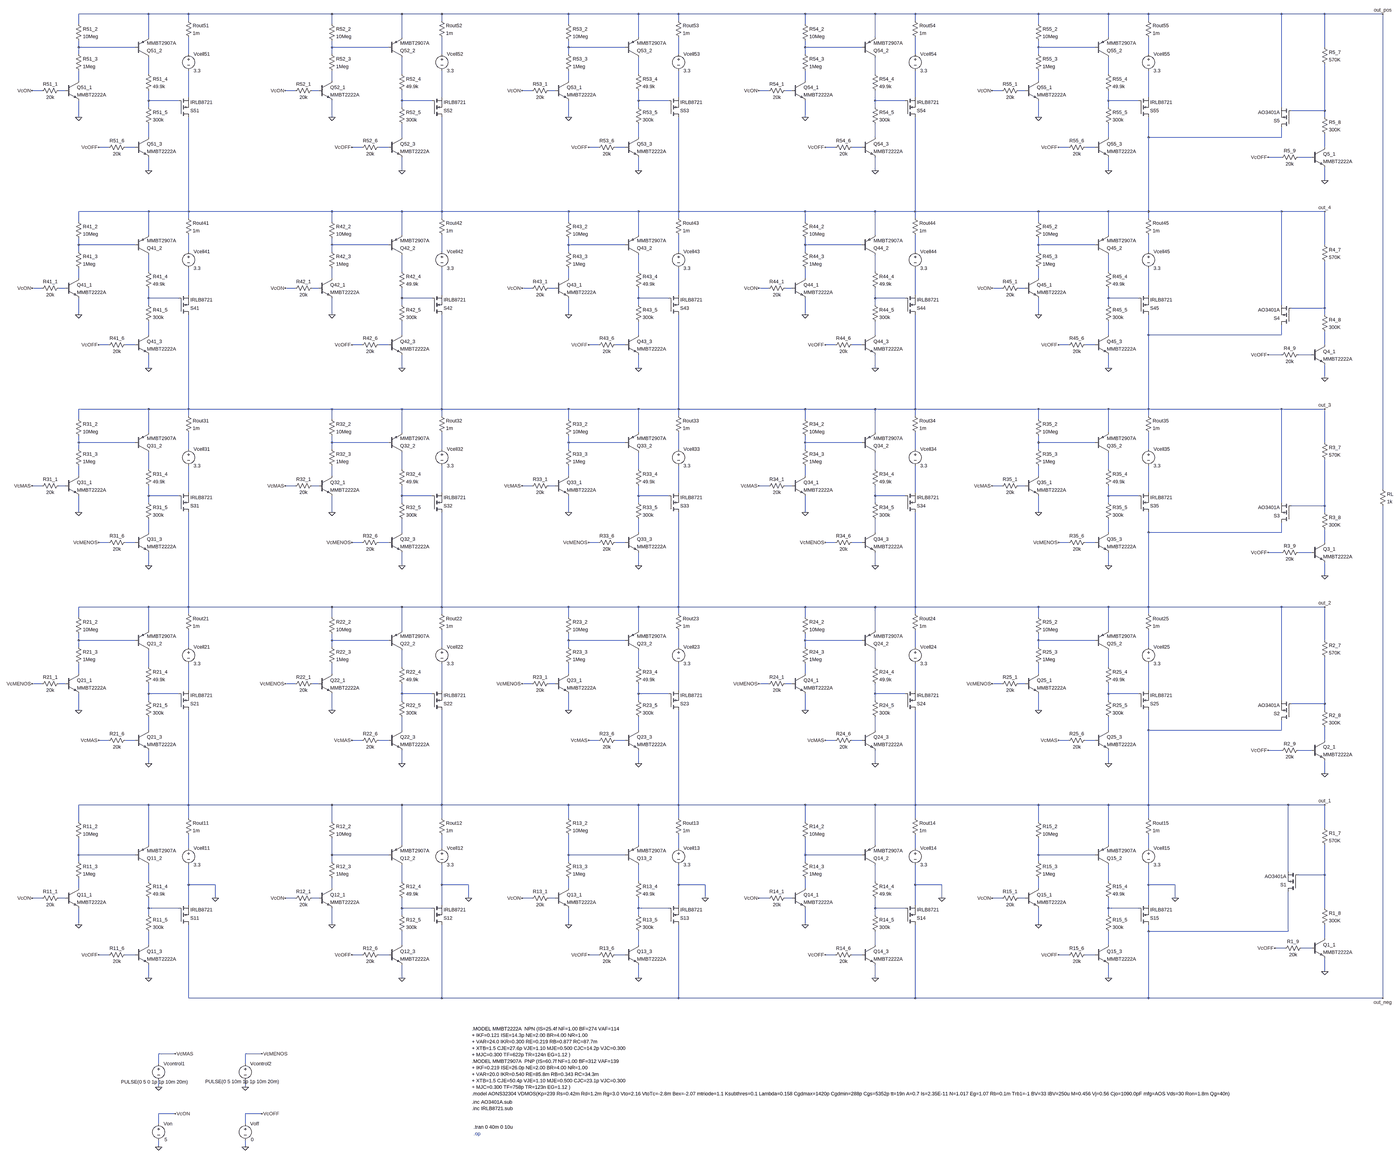
[diagram p0: schematic version2.1.asc, whole sheet]
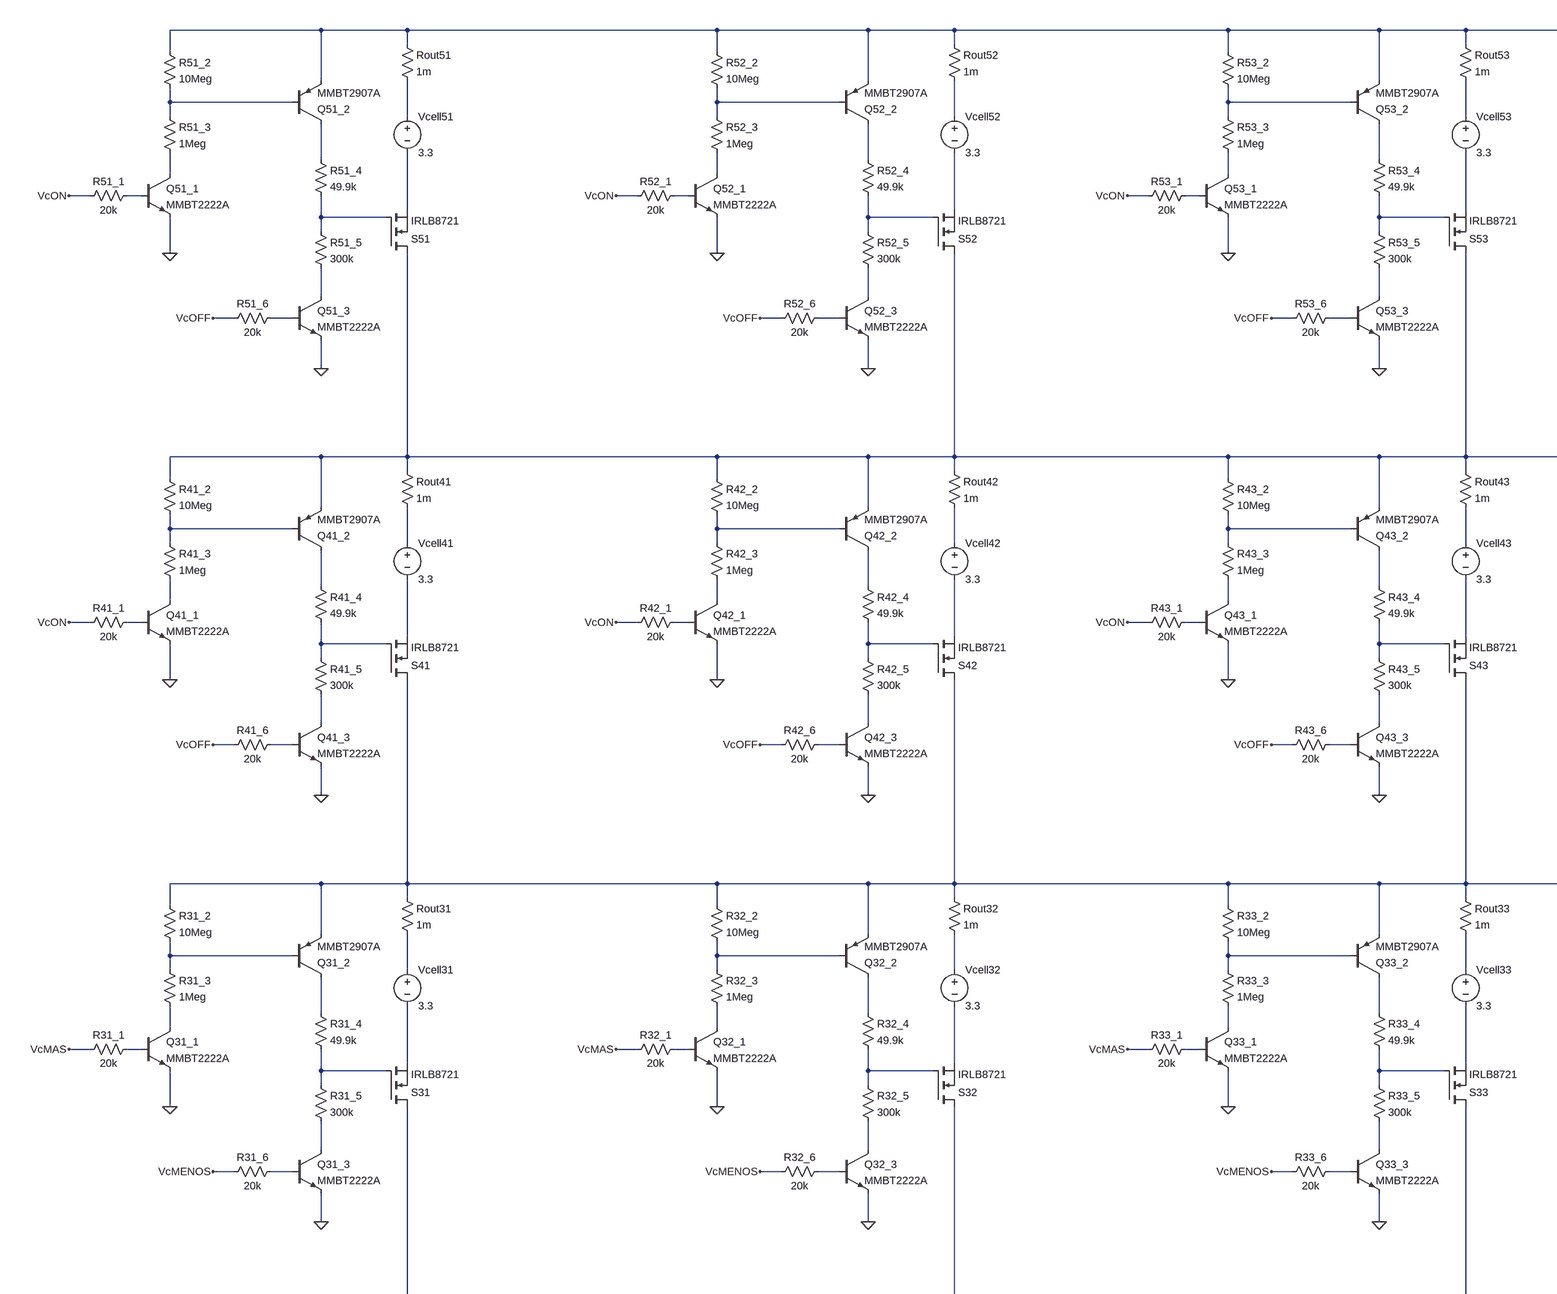
[diagram p1: schematic version2.1.asc, part, row 1 of 2, column 1 of 2]
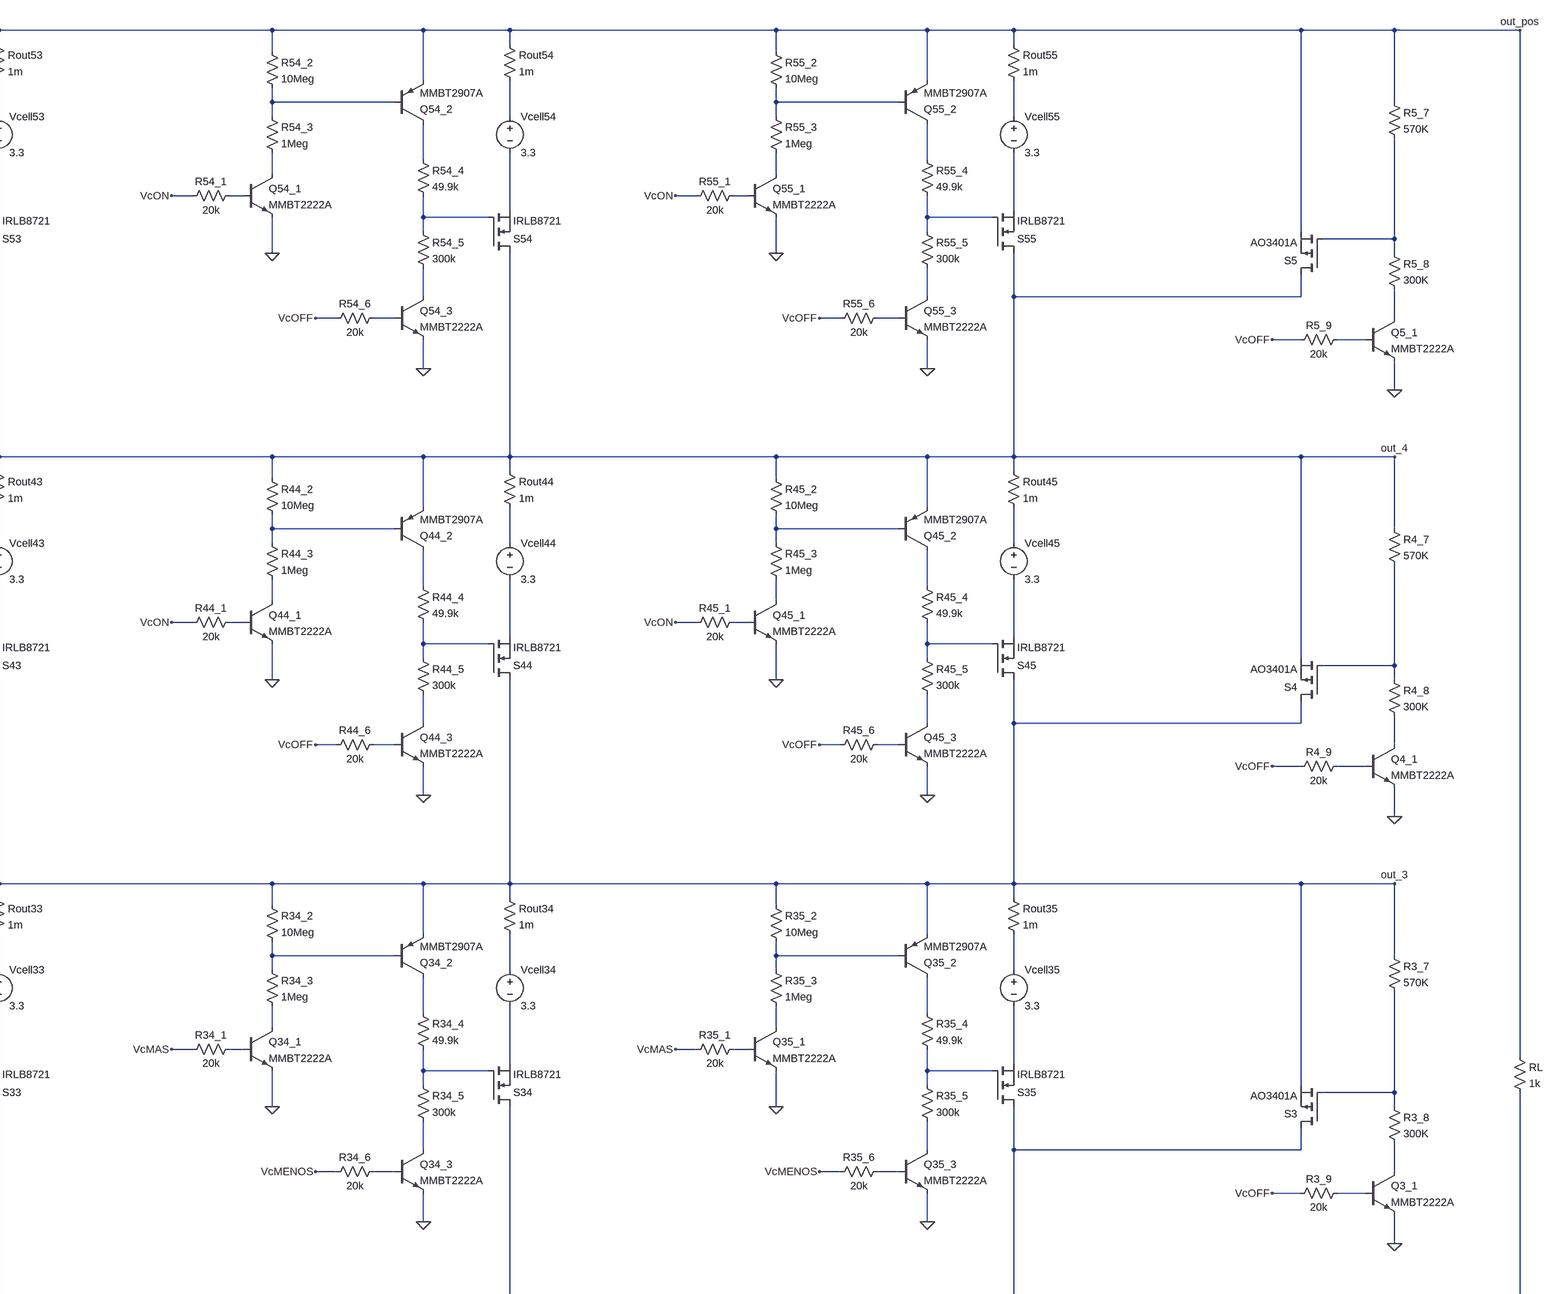
[diagram p2: schematic version2.1.asc, part, row 1 of 2, column 2 of 2]
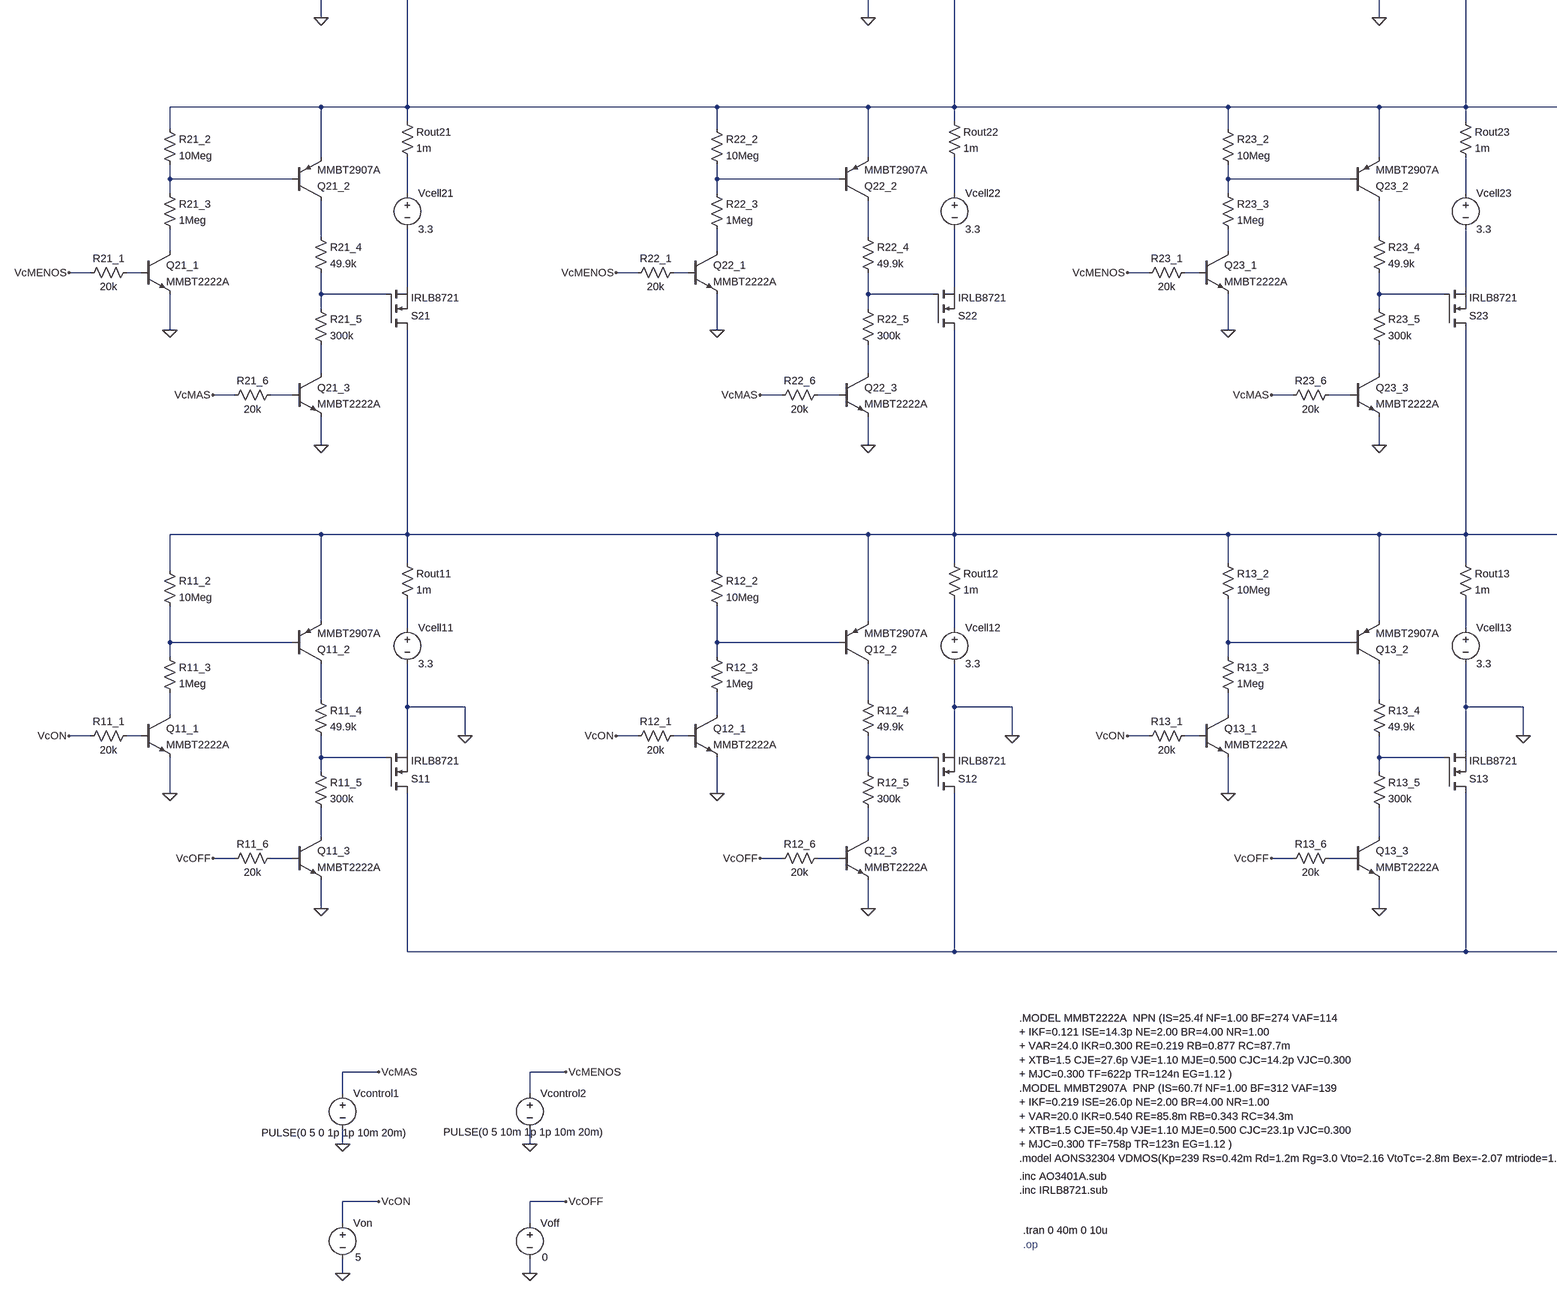
[diagram p3: schematic version2.1.asc, part, row 2 of 2, column 1 of 2]
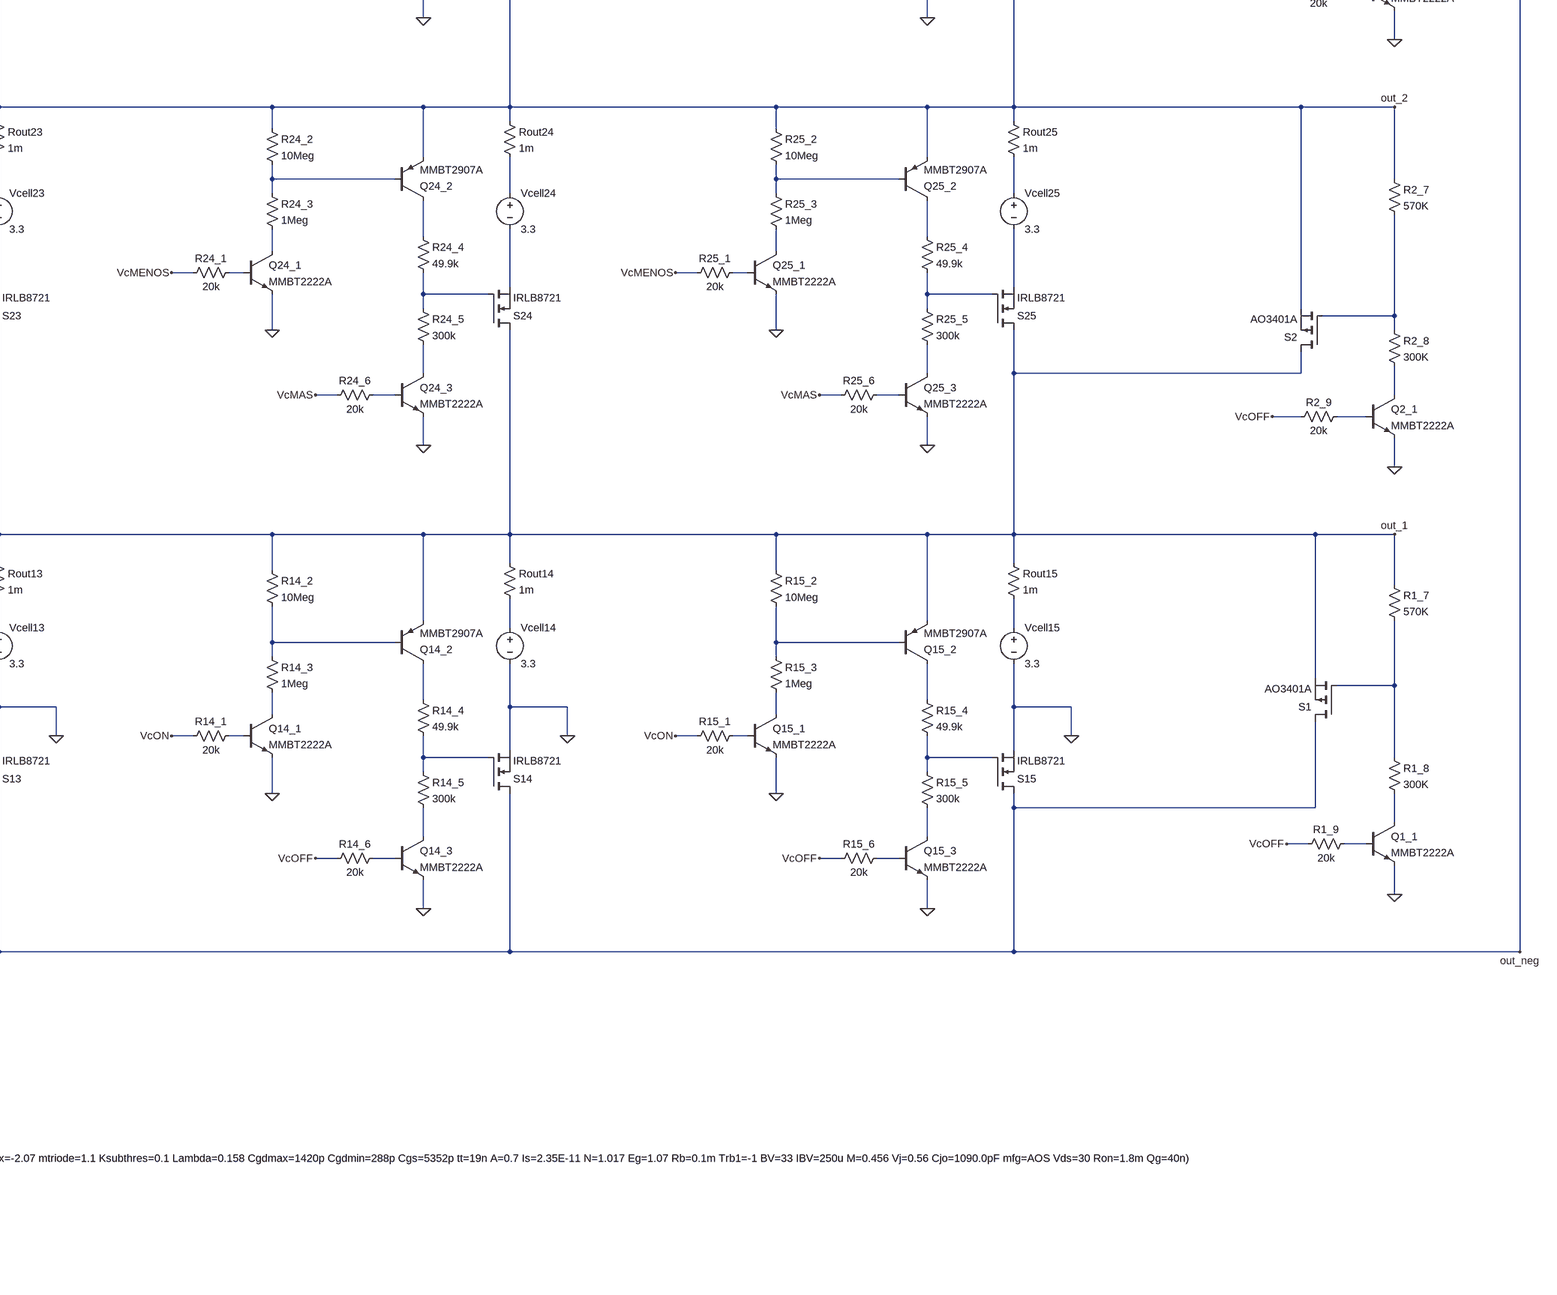
[diagram p4: schematic version2.1.asc, part, row 2 of 2, column 2 of 2]
* version2.1.asc
Q14_3 N228 N234 0 0 MMBT2222A
R14_5 N222 N228 300k
R14_4 N207 N222 49.9k
Q14_1 N212 N217 0 0 MMBT2222A
R14_3 N201 N212 1Meg
R14_2 out_1 N201 10Meg
R14_6 N234 VcOFF 20k
Vcell14 N196 0 3.3
Q14_2 N207 N201 out_1 0 MMBT2907A
X§S14 out_neg N222 0 IRLB8721  ; pins D G S
Q15_3 N229 N235 0 0 MMBT2222A
R15_5 N223 N229 300k
R15_4 N208 N223 49.9k
Q15_1 N213 N218 0 0 MMBT2222A
R15_3 N202 N213 1Meg
R15_2 out_1 N202 10Meg
R15_6 N235 VcOFF 20k
Vcell15 N197 0 3.3
Q15_2 N208 N202 out_1 0 MMBT2907A
X§S15 out_neg N223 0 IRLB8721  ; pins D G S
Q24_3 N184 N189 0 0 MMBT2222A
R24_5 N178 N184 300k
R24_4 N158 N178 49.9k
Q24_1 N163 N168 0 0 MMBT2222A
R24_3 N148 N163 1Meg
R24_2 out_2 N148 10Meg
R24_6 N189 VcMAS 20k
Vcell24 N153 N173 3.3
Q24_2 N158 N148 out_2 0 MMBT2907A
X§S24 out_1 N178 N173 IRLB8721  ; pins D G S
Q25_3 N185 N190 0 0 MMBT2222A
R25_5 N179 N185 300k
R25_4 N159 N179 49.9k
Q25_1 N164 N169 0 0 MMBT2222A
R25_3 N149 N164 1Meg
R25_2 out_2 N149 10Meg
R25_6 N190 VcMAS 20k
Vcell25 N154 N174 3.3
Q25_2 N159 N149 out_2 0 MMBT2907A
X§S25 out_1 N179 N174 IRLB8721  ; pins D G S
Vcontrol1 VcMAS 0 PULSE(0 5 0 1p 1p 10m 20m)
Vcontrol2 VcMENOS 0 PULSE(0 5 10m 1p 1p 10m 20m)
Voff VcOFF 0 0
Von VcON 0 5
R14_1 N217 VcON 20k
R24_1 N168 VcMENOS 20k
R25_1 N169 VcMENOS 20k
R15_1 N218 VcON 20k
RL out_pos out_neg 1k
Rout15 out_1 N197 1m
Rout14 out_1 N196 1m
Rout24 out_2 N153 1m
Rout25 out_2 N154 1m
Q1_1 N224 N230 0 0 MMBT2222A
R1_9 N230 VcOFF 20k
R1_8 N203 N224 300K
R1_7 out_1 N203 570K
Q2_1 N191 N192 0 0 MMBT2222A
R2_9 N192 VcOFF 20k
R2_8 N180 N191 300K
R2_7 out_2 N180 570K
X§S1 out_neg N203 out_1 AO3401A  ; pins D G S
X§S2 out_1 N180 out_2 AO3401A  ; pins D G S
Q34_3 N136 N141 0 0 MMBT2222A
R34_5 N130 N136 300k
R34_4 N110 N130 49.9k
Q34_1 N115 N120 0 0 MMBT2222A
R34_3 N100 N115 1Meg
R34_2 out_3 N100 10Meg
R34_6 N141 VcMENOS 20k
Vcell34 N105 N125 3.3
Q34_2 N110 N100 out_3 0 MMBT2907A
X§S34 out_2 N130 N125 IRLB8721  ; pins D G S
Q35_3 N137 N142 0 0 MMBT2222A
R35_5 N131 N137 300k
R35_4 N111 N131 49.9k
Q35_1 N116 N121 0 0 MMBT2222A
R35_3 N101 N116 1Meg
R35_2 out_3 N101 10Meg
R35_6 N142 VcMENOS 20k
Vcell35 N106 N126 3.3
Q35_2 N111 N101 out_3 0 MMBT2907A
X§S35 out_2 N131 N126 IRLB8721  ; pins D G S
R34_1 N120 VcMAS 20k
R35_1 N121 VcMAS 20k
Rout34 out_3 N105 1m
Rout35 out_3 N106 1m
Q3_1 N143 N144 0 0 MMBT2222A
R3_9 N144 VcOFF 20k
R3_8 N132 N143 300K
R3_7 out_3 N132 570K
X§S3 out_2 N132 out_3 AO3401A  ; pins D G S
Q44_3 N088 N093 0 0 MMBT2222A
R44_5 N082 N088 300k
R44_4 N062 N082 49.9k
Q44_1 N067 N072 0 0 MMBT2222A
R44_3 N052 N067 1Meg
R44_2 out_4 N052 10Meg
R44_6 N093 VcOFF 20k
Vcell44 N057 N077 3.3
Q44_2 N062 N052 out_4 0 MMBT2907A
X§S44 out_3 N082 N077 IRLB8721  ; pins D G S
Q45_3 N089 N094 0 0 MMBT2222A
R45_5 N083 N089 300k
R45_4 N063 N083 49.9k
Q45_1 N068 N073 0 0 MMBT2222A
R45_3 N053 N068 1Meg
R45_2 out_4 N053 10Meg
R45_6 N094 VcOFF 20k
Vcell45 N058 N078 3.3
Q45_2 N063 N053 out_4 0 MMBT2907A
X§S45 out_3 N083 N078 IRLB8721  ; pins D G S
R44_1 N072 VcON 20k
R45_1 N073 VcON 20k
Rout44 out_4 N057 1m
Rout45 out_4 N058 1m
Q4_1 N095 N096 0 0 MMBT2222A
R4_9 N096 VcOFF 20k
R4_8 N084 N095 300K
R4_7 out_4 N084 570K
X§S4 out_3 N084 out_4 AO3401A  ; pins D G S
Q13_3 N227 N233 0 0 MMBT2222A
R13_5 N221 N227 300k
R13_4 N206 N221 49.9k
Q13_1 N211 N216 0 0 MMBT2222A
R13_3 N200 N211 1Meg
R13_2 out_1 N200 10Meg
R13_6 N233 VcOFF 20k
Vcell13 N195 0 3.3
Q13_2 N206 N200 out_1 0 MMBT2907A
X§S13 out_neg N221 0 IRLB8721  ; pins D G S
Q23_3 N183 N188 0 0 MMBT2222A
R23_5 N177 N183 300k
R23_4 N157 N177 49.9k
Q23_1 N162 N167 0 0 MMBT2222A
R23_3 N147 N162 1Meg
R23_2 out_2 N147 10Meg
R23_6 N188 VcMAS 20k
Vcell23 N152 N172 3.3
Q23_2 N157 N147 out_2 0 MMBT2907A
X§S23 out_1 N177 N172 IRLB8721  ; pins D G S
R13_1 N216 VcON 20k
R23_1 N167 VcMENOS 20k
Rout13 out_1 N195 1m
Rout23 out_2 N152 1m
Q33_3 N135 N140 0 0 MMBT2222A
R33_5 N129 N135 300k
R33_4 N109 N129 49.9k
Q33_1 N114 N119 0 0 MMBT2222A
R33_3 N099 N114 1Meg
R33_2 out_3 N099 10Meg
R33_6 N140 VcMENOS 20k
Vcell33 N104 N124 3.3
Q33_2 N109 N099 out_3 0 MMBT2907A
X§S33 out_2 N129 N124 IRLB8721  ; pins D G S
R33_1 N119 VcMAS 20k
Rout33 out_3 N104 1m
Q43_3 N087 N092 0 0 MMBT2222A
R43_5 N081 N087 300k
R43_4 N061 N081 49.9k
Q43_1 N066 N071 0 0 MMBT2222A
R43_3 N051 N066 1Meg
R43_2 out_4 N051 10Meg
R43_6 N092 VcOFF 20k
Vcell43 N056 N076 3.3
Q43_2 N061 N051 out_4 0 MMBT2907A
X§S43 out_3 N081 N076 IRLB8721  ; pins D G S
R43_1 N071 VcON 20k
Rout43 out_4 N056 1m
Q54_3 N040 N045 0 0 MMBT2222A
R54_5 N034 N040 300k
R54_4 N014 N034 49.9k
Q54_1 N019 N024 0 0 MMBT2222A
R54_3 N004 N019 1Meg
R54_2 out_pos N004 10Meg
R54_6 N045 VcOFF 20k
Vcell54 N009 N029 3.3
Q54_2 N014 N004 out_pos 0 MMBT2907A
X§S54 out_4 N034 N029 IRLB8721  ; pins D G S
Q55_3 N041 N046 0 0 MMBT2222A
R55_5 N035 N041 300k
R55_4 N015 N035 49.9k
Q55_1 N020 N025 0 0 MMBT2222A
R55_3 N005 N020 1Meg
R55_2 out_pos N005 10Meg
R55_6 N046 VcOFF 20k
Vcell55 N010 N030 3.3
Q55_2 N015 N005 out_pos 0 MMBT2907A
X§S55 out_4 N035 N030 IRLB8721  ; pins D G S
R54_1 N024 VcON 20k
R55_1 N025 VcON 20k
Rout54 out_pos N009 1m
Rout55 out_pos N010 1m
Q5_1 N047 N048 0 0 MMBT2222A
R5_9 N048 VcOFF 20k
R5_8 N036 N047 300K
R5_7 out_pos N036 570K
X§S5 out_4 N036 out_pos AO3401A  ; pins D G S
Q53_3 N039 N044 0 0 MMBT2222A
R53_5 N033 N039 300k
R53_4 N013 N033 49.9k
Q53_1 N018 N023 0 0 MMBT2222A
R53_3 N003 N018 1Meg
R53_2 out_pos N003 10Meg
R53_6 N044 VcOFF 20k
Vcell53 N008 N028 3.3
Q53_2 N013 N003 out_pos 0 MMBT2907A
X§S53 out_4 N033 N028 IRLB8721  ; pins D G S
R53_1 N023 VcON 20k
Rout53 out_pos N008 1m
Q12_3 N226 N232 0 0 MMBT2222A
R12_5 N220 N226 300k
R12_4 N205 N220 49.9k
Q12_1 N210 N215 0 0 MMBT2222A
R12_3 N199 N210 1Meg
R12_2 out_1 N199 10Meg
R12_6 N232 VcOFF 20k
Vcell12 N194 0 3.3
Q12_2 N205 N199 out_1 0 MMBT2907A
X§S12 out_neg N220 0 IRLB8721  ; pins D G S
Q22_3 N182 N187 0 0 MMBT2222A
R22_5 N176 N182 300k
R22_4 N156 N176 49.9k
Q22_1 N161 N166 0 0 MMBT2222A
R22_3 N146 N161 1Meg
R22_2 out_2 N146 10Meg
R22_6 N187 VcMAS 20k
Vcell22 N151 N171 3.3
Q22_2 N156 N146 out_2 0 MMBT2907A
X§S22 out_1 N176 N171 IRLB8721  ; pins D G S
R12_1 N215 VcON 20k
R22_1 N166 VcMENOS 20k
Rout12 out_1 N194 1m
Rout22 out_2 N151 1m
Q32_3 N134 N139 0 0 MMBT2222A
R32_5 N128 N134 300k
R32_4 N108 N128 49.9k
Q32_1 N113 N118 0 0 MMBT2222A
R32_3 N098 N113 1Meg
R32_2 out_3 N098 10Meg
R32_6 N139 VcMENOS 20k
Vcell32 N103 N123 3.3
Q32_2 N108 N098 out_3 0 MMBT2907A
X§S32 out_2 N128 N123 IRLB8721  ; pins D G S
R32_1 N118 VcMAS 20k
Rout32 out_3 N103 1m
Q42_3 N086 N091 0 0 MMBT2222A
R42_5 N080 N086 300k
R42_4 N060 N080 49.9k
Q42_1 N065 N070 0 0 MMBT2222A
R42_3 N050 N065 1Meg
R42_2 out_4 N050 10Meg
R42_6 N091 VcOFF 20k
Vcell42 N055 N075 3.3
Q42_2 N060 N050 out_4 0 MMBT2907A
X§S42 out_3 N080 N075 IRLB8721  ; pins D G S
R42_1 N070 VcON 20k
Rout42 out_4 N055 1m
Q11_3 N225 N231 0 0 MMBT2222A
R11_5 N219 N225 300k
R11_4 N204 N219 49.9k
Q11_1 N209 N214 0 0 MMBT2222A
R11_3 N198 N209 1Meg
R11_2 out_1 N198 10Meg
R11_6 N231 VcOFF 20k
Vcell11 N193 0 3.3
Q11_2 N204 N198 out_1 0 MMBT2907A
X§S11 out_neg N219 0 IRLB8721  ; pins D G S
Q21_3 N181 N186 0 0 MMBT2222A
R21_5 N175 N181 300k
R21_4 N155 N175 49.9k
Q21_1 N160 N165 0 0 MMBT2222A
R21_3 N145 N160 1Meg
R21_2 out_2 N145 10Meg
R21_6 N186 VcMAS 20k
Vcell21 N150 N170 3.3
Q21_2 N155 N145 out_2 0 MMBT2907A
X§S21 out_1 N175 N170 IRLB8721  ; pins D G S
R11_1 N214 VcON 20k
R21_1 N165 VcMENOS 20k
Rout11 out_1 N193 1m
Rout21 out_2 N150 1m
Q31_3 N133 N138 0 0 MMBT2222A
R31_5 N127 N133 300k
R31_4 N107 N127 49.9k
Q31_1 N112 N117 0 0 MMBT2222A
R31_3 N097 N112 1Meg
R31_2 out_3 N097 10Meg
R31_6 N138 VcMENOS 20k
Vcell31 N102 N122 3.3
Q31_2 N107 N097 out_3 0 MMBT2907A
X§S31 out_2 N127 N122 IRLB8721  ; pins D G S
R31_1 N117 VcMAS 20k
Rout31 out_3 N102 1m
Q41_3 N085 N090 0 0 MMBT2222A
R41_5 N079 N085 300k
R41_4 N059 N079 49.9k
Q41_1 N064 N069 0 0 MMBT2222A
R41_3 N049 N064 1Meg
R41_2 out_4 N049 10Meg
R41_6 N090 VcOFF 20k
Vcell41 N054 N074 3.3
Q41_2 N059 N049 out_4 0 MMBT2907A
X§S41 out_3 N079 N074 IRLB8721  ; pins D G S
R41_1 N069 VcON 20k
Rout41 out_4 N054 1m
Q52_3 N038 N043 0 0 MMBT2222A
R52_5 N032 N038 300k
R52_4 N012 N032 49.9k
Q52_1 N017 N022 0 0 MMBT2222A
R52_3 N002 N017 1Meg
R52_2 out_pos N002 10Meg
R52_6 N043 VcOFF 20k
Vcell52 N007 N027 3.3
Q52_2 N012 N002 out_pos 0 MMBT2907A
X§S52 out_4 N032 N027 IRLB8721  ; pins D G S
R52_1 N022 VcON 20k
Rout52 out_pos N007 1m
Q51_3 N037 N042 0 0 MMBT2222A
R51_5 N031 N037 300k
R51_4 N011 N031 49.9k
Q51_1 N016 N021 0 0 MMBT2222A
R51_3 N001 N016 1Meg
R51_2 out_pos N001 10Meg
R51_6 N042 VcOFF 20k
Vcell51 N006 N026 3.3
Q51_2 N011 N001 out_pos 0 MMBT2907A
X§S51 out_4 N031 N026 IRLB8721  ; pins D G S
R51_1 N021 VcON 20k
Rout51 out_pos N006 1m
.model NPN NPN
.model PNP PNP
.lib standard.bjt
.tran 0 40m 0 10u
.MODEL MMBT2222A  NPN (IS=25.4f NF=1.00 BF=274 VAF=114
+ IKF=0.121 ISE=14.3p NE=2.00 BR=4.00 NR=1.00
+ VAR=24.0 IKR=0.300 RE=0.219 RB=0.877 RC=87.7m
+ XTB=1.5 CJE=27.6p VJE=1.10 MJE=0.500 CJC=14.2p VJC=0.300
+ MJC=0.300 TF=622p TR=124n EG=1.12 )
.MODEL MMBT2907A  PNP (IS=60.7f NF=1.00 BF=312 VAF=139
+ IKF=0.219 ISE=26.0p NE=2.00 BR=4.00 NR=1.00
+ VAR=20.0 IKR=0.540 RE=85.8m RB=0.343 RC=34.3m
+ XTB=1.5 CJE=50.4p VJE=1.10 MJE=0.500 CJC=23.1p VJC=0.300
+ MJC=0.300 TF=758p TR=123n EG=1.12 )
.model AONS32304 VDMOS(Kp=239 Rs=0.42m Rd=1.2m Rg=3.0 Vto=2.16 VtoTc=-2.8m Bex=-2.07 mtriode=1.1 Ksubthres=0.1 Lambda=0.158 Cgdmax=1420p Cgdmin=288p Cgs=5352p tt=19n A=0.7 Is=2.35E-11 N=1.017 Eg=1.07 Rb=0.1m Trb1=-1 BV=33 IBV=250u M=0.456 Vj=0.56 Cjo=1090.0pF mfg=AOS Vds=30 Ron=1.8m Qg=40n)
.inc AO3401A.sub
.inc IRLB8721.sub
* .op
.backanno
.end